# EasyEDA Pro project f1c200s测试板V1.0.eprj, schematic Schematic1
Create Date: 2023-12-29; Page Name: P1; Project Name: f1c200s测试板V1.0; Schematic Name: Schematic1; Update Date: 2024-01-06; Company: 嘉立创EDA; Drawed: lhdjply; Page Size: A4; Reviewed: lhdjply; Version: V1.0
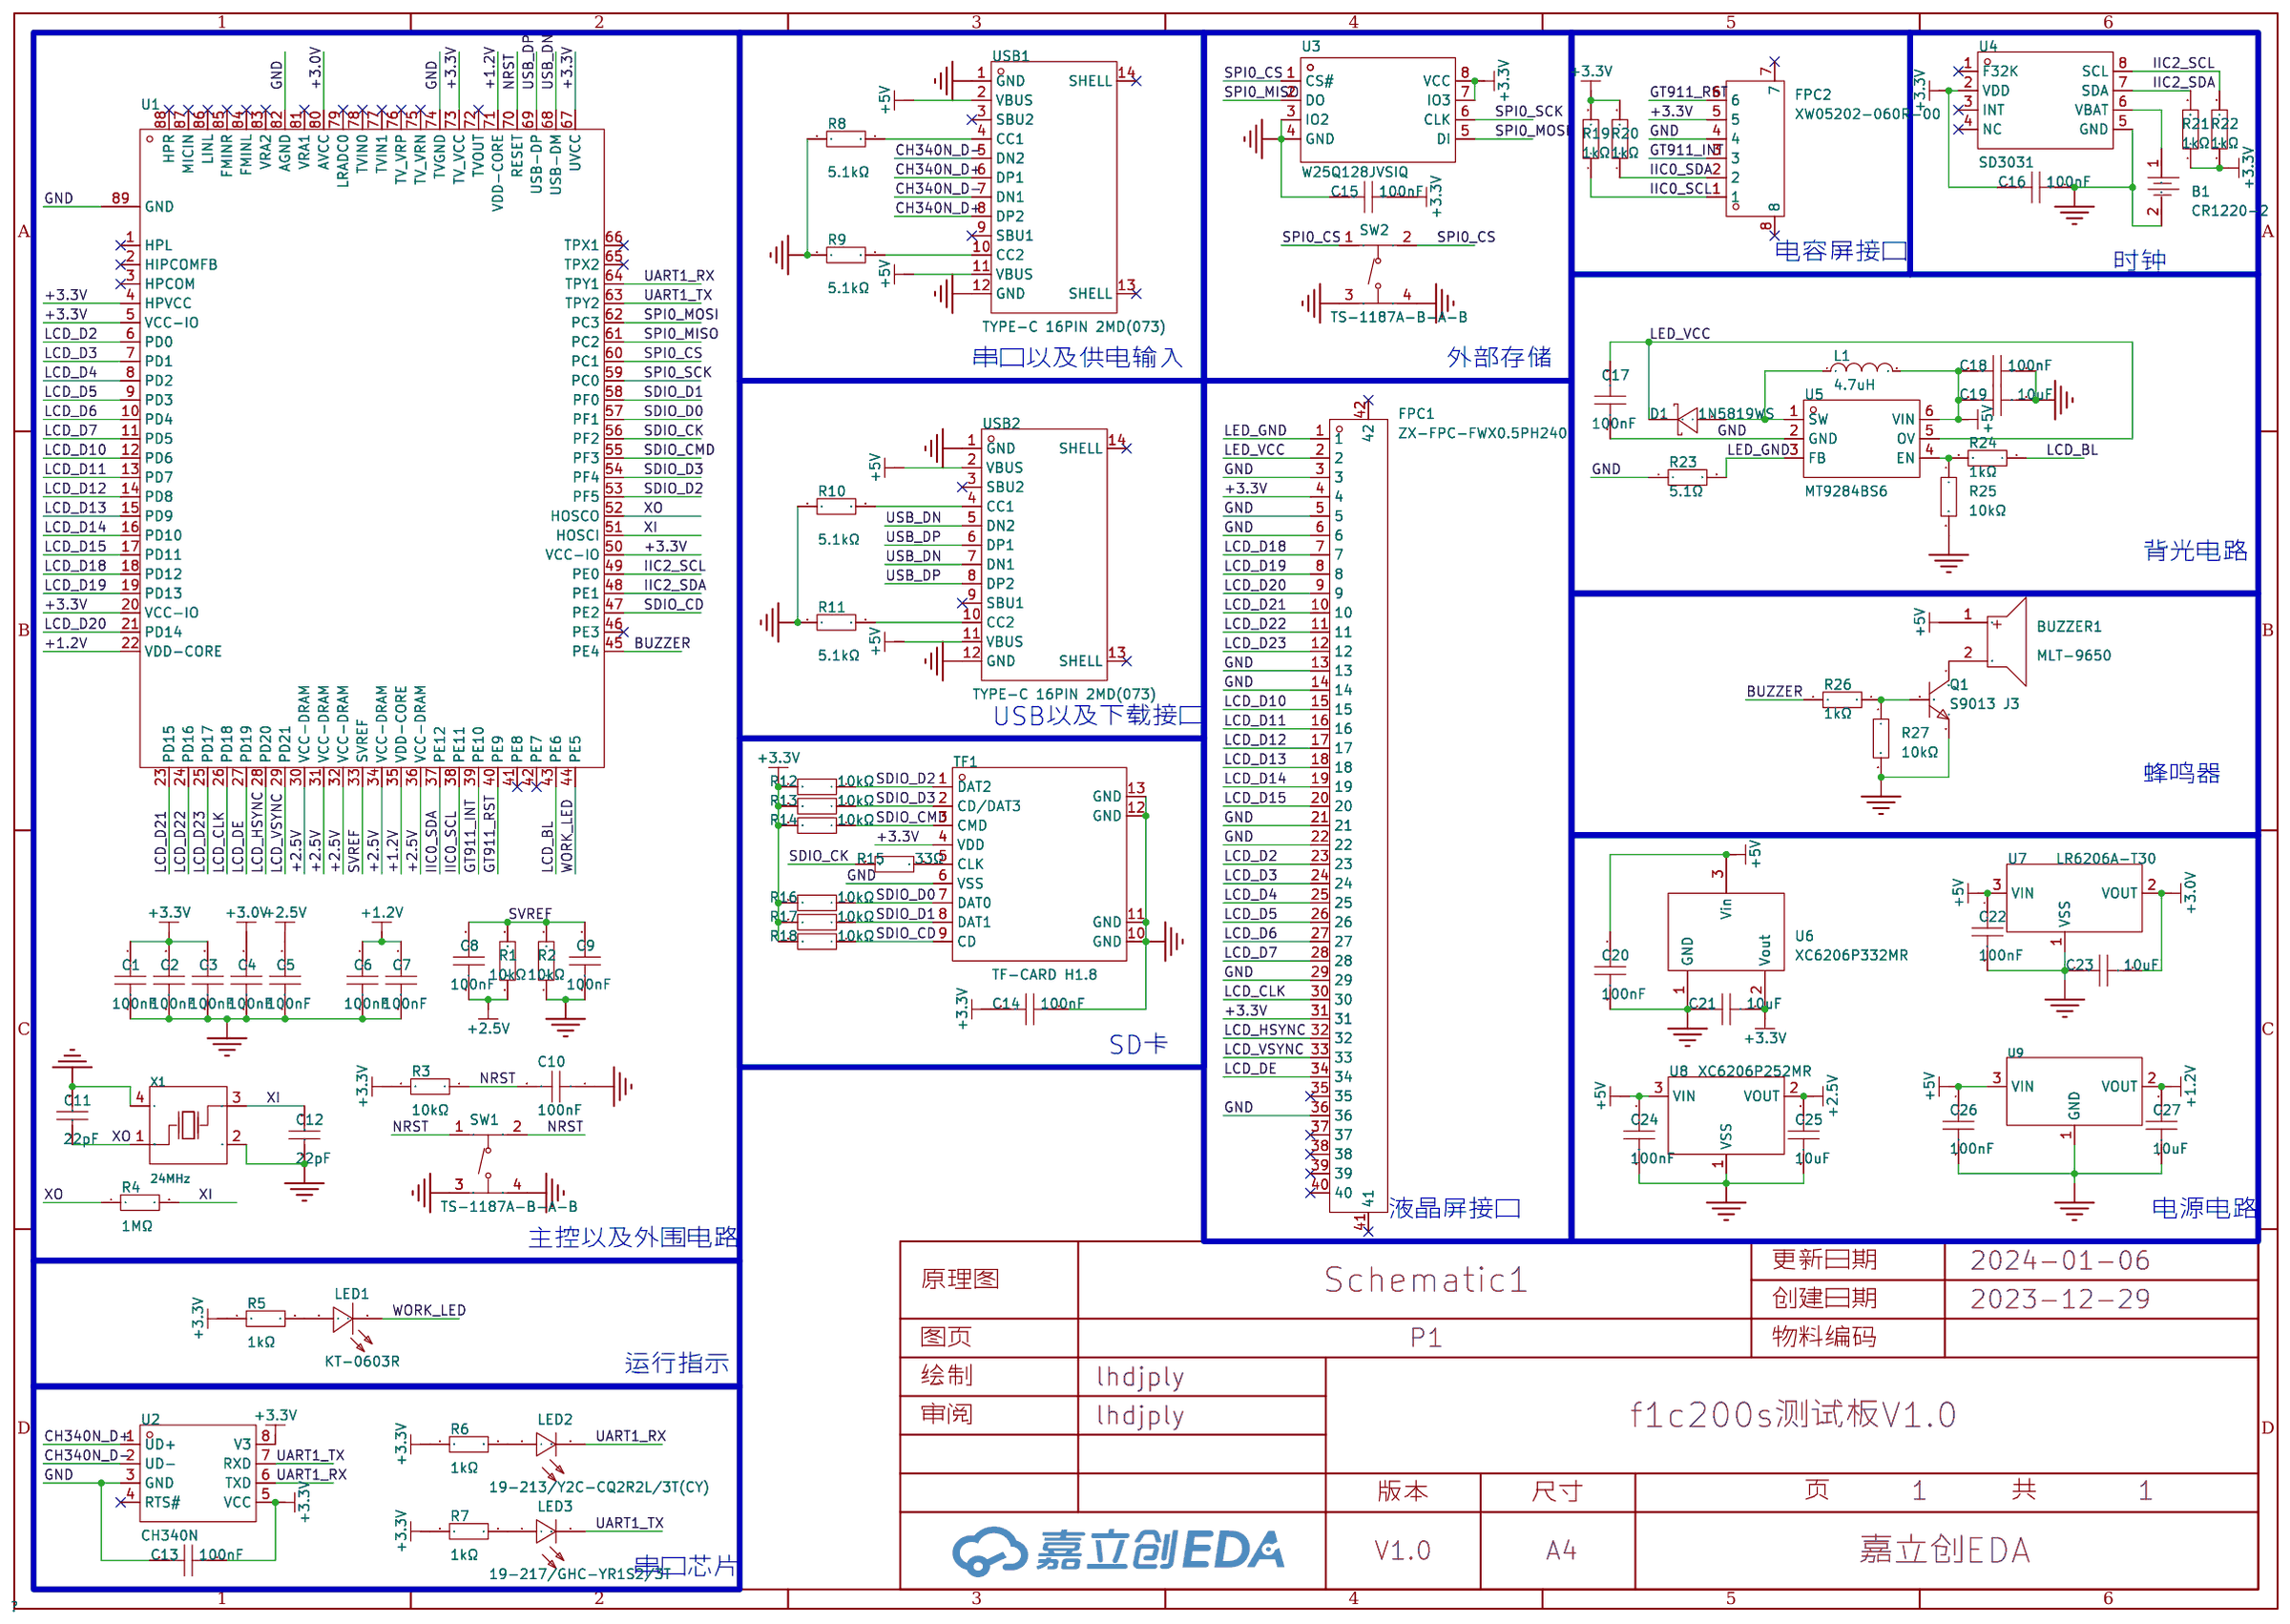
[diagram p0: schematic sheet]

## Parts
B1  CR1220-2  [BAT-SMD_CR1220-2]
BUZZER1  2700Hz  [BUZ-SMD_L9.6-W9.6-LS10.0-R]
C1  100nF  [C0603]
C2  100nF  [C0603]
C3  100nF  [C0603]
C4  100nF  [C0603]
C5  100nF  [C0603]
C6  100nF  [C0603]
C7  100nF  [C0603]
C8  100nF  [C0603]
C9  100nF  [C0603]
C10  100nF  [C0603]
C11  22pF  [C0603]
C12  22pF  [C0603]
C13  100nF  [C0603]
C14  100nF  [C0603]
C15  100nF  [C0603]
C16  100nF  [C0603]
C17  100nF  [C0603]
C18  100nF  [C0603]
C19  10uF  [C0603]
C20  100nF  [C0603]
C21  10uF  [C0603]
C22  100nF  [C0603]
C23  10uF  [C0603]
C24  100nF  [C0603]
C25  10uF  [C0603]
C26  100nF  [C0603]
C27  10uF  [C0603]
D1  1N5819WS  [SOD-323_L1.8-W1.3-LS2.5-RD]
FPC1  ZX-FPC-FWX0.5PH240  [FPC-SMD_40P-P0.50_MEGASTAR_ZX-FPC-FWX0.5PH240]
FPC2  XW05202-060R-00  [FPC-SMD_XW05202-060R-00]
L1  4.7uH  [IND-SMD_L5.8-W5.2_SLF05XX]
LED1  KT-0603R  [LED0603-RD]
LED2  19-213/Y2C-CQ2R2L/3T(CY)  [LED0603-RD-YELLOW]
LED3  19-217/GHC-YR1S2/3T  [LED0603-RD]
Q1  S9013 J3  [SOT-23-3_L2.9-W1.3-P1.90-LS2.4-BR]
R1  10kΩ  [R0603]
R2  10kΩ  [R0603]
R3  10kΩ  [R0603]
R4  1MΩ  [R0603]
R5  1kΩ  [R0603]
R6  1kΩ  [R0603]
R7  1kΩ  [R0603]
R8  5.1kΩ  [R0603]
R9  5.1kΩ  [R0603]
R10  5.1kΩ  [R0603]
R11  5.1kΩ  [R0603]
R12  10kΩ  [R0603]
R13  10kΩ  [R0603]
R14  10kΩ  [R0603]
R15  33Ω  [R0603]
R16  10kΩ  [R0603]
R17  10kΩ  [R0603]
R18  10kΩ  [R0603]
R19  1kΩ  [R0603]
R20  1kΩ  [R0603]
R21  1kΩ  [R0603]
R22  1kΩ  [R0603]
R23  5.1Ω  [R0603]
R24  1kΩ  [R0603]
R25  10kΩ  [R0603]
R26  1kΩ  [R0603]
R27  10kΩ  [R0603]
SW1  TS-1187A-B-A-B  [SW-SMD_4P-L5.1-W5.1-P3.70-LS6.5-TL-2]
SW2  TS-1187A-B-A-B  [SW-SMD_4P-L5.1-W5.1-P3.70-LS6.5-TL-2]
TF1  TF-CARD H1.8  [TF-SMD_TF-CARD-H1.8]
U1  F1C200S  [QFN-88_L10.0-W10.0-P0.40-BL-EP6.75]
U2  CH340N  [SOP-8_L4.9-W3.9-P1.27-LS6.0-BL]
U3  W25Q128JVSIQ  [SOIC-8_L5.3-W5.3-P1.27-LS8.0-BL]
U4  SD3031  [SOP-8_L5.3-W5.3-P1.27-LS8.0-BL]
U5  MT9284BS6  [SOT-23-6_L2.9-W1.6-P0.95-LS2.8-BR]
U6  XC6206P332MR  [SOT-23-3_L2.9-W1.6-P1.90-LS2.8-BR]
U7  LR6206A-T30  [SOT-23-3_L2.9-W1.3-P1.90-LS2.4-BR]
U8  XC6206P252MR  [SOT-23-3_L2.9-W1.3-P1.90-LS2.4-BR]
U9  LR8103A-T12  [SOT-23-3_L2.9-W1.6-P1.90-LS2.8-BR]
USB1  TYPE-C 16PIN 2MD(073)  [USB-C-SMD_TYPE-C-6PIN-2MD-073]
USB2  TYPE-C 16PIN 2MD(073)  [USB-C-SMD_TYPE-C-6PIN-2MD-073]
X1  24MHz  [CRYSTAL-SMD_4P-L3.2-W2.5-BL-2]

## Library data of the parts
B1 = CR1220-2: 连接器类型:电池底座;适用电池规格:CR1220;工作温度范围:-;; LCSC Part Name: 电池底座 适用电池:CR1220; Supplier Part: C70381; Manufacturer: Q&amp;J; Supplier Footprint: SMD; JLCPCB Part Class: Extended Part; Datasheet: https://atta.szlcsc.com/upload/public/pdf/source/20160427/1461725216696.pdf; Supplier: LCSC; Connector Type: 电池底座; Battery Type: CR1220
BUZZER1 = MLT-9650: 驱动方式:有源(内含驱动线路);构造类型:电磁式;额定电压:5V;工作电压:3V~7V;频率:2700Hz;声压(SPL):85dB@5V,10cm;长度:9.6mm;宽度:9.6mm;高度:5.5mm;; LCSC Part Name: 耐环保MLT-9650; Supplier Part: C96127; Manufacturer: 华能; JLCPCB Part Class: 扩展库; Datasheet: https://atta.szlcsc.com/upload/public/pdf/source/20170914/C96127_1505374148680969227.pdf; Supplier: LCSC; Oscillator Circuit: 有源(内含驱动线路); Technology Type: 电磁式; Rated Voltage: 5V; Operating Voltage: 3V~7V; Sound Pressure Level (SPL): 85dB@5V,10cm; Length: 9.6mm; Width: 9.6mm; Height: 5.5mm
C1-C10 C13-C18 C20 C22 C24 C26 = CC0603KRX7R9BB104: 容值:100nF;精度:±10%;额定电压:50V;材质(温度系数):X7R;; LCSC Part Name: 100nF ±10% 50V; Supplier Part: C14663; Manufacturer: YAGEO(国巨); Supplier Footprint: 0603; JLCPCB Part Class: 基础库; Datasheet: https://atta.szlcsc.com/upload/public/pdf/source/20180910/C282072_33301C7F631E79921B82A8DAC6BCC5B3.pdf; Supplier: LCSC; Tolerance: ±10%; Voltage Rated: 50V; Temperature Coefficient: X7R
C11 C12 = CL10C220JB8NNNC: 容值:22pF;精度:±5%;额定电压:50V;材质(温度系数):C0G;; LCSC Part Name: 22pF ±5% 50V; Supplier Part: C1653; Manufacturer: SAMSUNG(三星); Supplier Footprint: 0603; JLCPCB Part Class: 基础库; Datasheet: https://atta.szlcsc.com/upload/public/pdf/source/20160218/1457707763339.pdf; Supplier: LCSC; Tolerance: ±5%; Voltage Rated: 50V; Temperature Coefficient: C0G
C19 C21 C23 C25 C27 = CL10A106KP8NNNC: 容值:10uF;精度:±10%;额定电压:10V;材质(温度系数):X5R;; LCSC Part Name: 10uF ±10% 10V; Supplier Part: C19702; Manufacturer: SAMSUNG(三星); Supplier Footprint: 0603; JLCPCB Part Class: 基础库; Datasheet: https://atta.szlcsc.com/upload/public/pdf/source/20160218/1457707763339.pdf; Supplier: LCSC; Tolerance: ±10%; Voltage Rated: 10V; Temperature Coefficient: X5R
D1 = 1N5819WS_C191023: 正向压降(Vf):600mV@1A;直流反向耐压(Vr):40V;平均整流电流(Io):1A;; LCSC Part Name: 电压:40V 电流:1A; Supplier Part: C191023; Manufacturer: Hottech(合科泰); Supplier Footprint: SOD-323; JLCPCB Part Class: 基础库; Datasheet: https://atta.szlcsc.com/upload/public/pdf/source/20220428/3CB86FD8D28D653594B4E35F9D5AEFD9.pdf; Supplier: LCSC; Forward Voltage (Vf@If): 600mV@1A; Reverse Voltage (Vr): 40V; Average Rectified Current (Io): 1A
FPC1 = ZX-FPC-FWX0.5PH240: 间距:0.5mm;触点数量:40P;锁定特性:翻盖式;触点类型:下接;安装类型:卧贴;工作温度范围:-25℃~+85℃;焊接温度(最大值):260℃;; LCSC Part Name: 间距:0.5mm P数:40P 翻盖式 下接; Supplier Part: C7419871; Manufacturer: Megastar(兆星); Supplier Footprint: SMD,P=0.5mm,卧贴; JLCPCB Part Class: 扩展库; Datasheet: https://atta.szlcsc.com/upload/public/pdf/source/20230601/0995AEA2524149388278E8B9E81F922A.pdf; Supplier: LCSC; Pitch: 0.5mm; Number of Contacts: 40P; Locking Feature: 翻盖式; FFC, FCB Thickness: 0.3mm; Contact Type: 下接; Mounting Type: 卧贴; Height Above Board: 2mm; Operating Temperature Range: -25℃~+85℃; Welding Temperature (Max): 260℃
FPC2 = XW05202-060R-00: 间距:0.5mm;触点数量:6P;锁定特性:翻盖式;触点类型:下接;安装类型:卧贴;工作温度范围:-25℃~+85℃;; LCSC Part Name: 间距:0.5mm P数:6P 翻盖式 下接; Supplier Part: C2906110; Manufacturer: HCTL(华灿天禄); Supplier Footprint: SMD,P=0.5mm,卧贴; JLCPCB Part Class: 扩展库; Datasheet: https://atta.szlcsc.com/upload/public/pdf/source/20231106/C384EBACC26E247929F51DC405C2A717.pdf; Supplier: LCSC; Pitch: 0.5mm; Number of Contacts: 6P; Locking Feature: 翻盖式; FFC, FCB Thickness: 0.3mm; Contact Type: 下接; Mounting Type: 卧贴; Height Above Board: 2mm; Operating Temperature Range: -25℃~+85℃
L1 = CD54N-4R7M: 电感值:4.7uH;精度:±20%;额定电流:3A;饱和电流(Isat):3A;; LCSC Part Name: 4.7uH ±20% 3A 80mΩ; Supplier Part: C2875604; Manufacturer: MINGSTAR(登壹); Supplier Footprint: SMD,5.5x5.8mm; JLCPCB Part Class: 扩展库; Datasheet: https://atta.szlcsc.com/upload/public/pdf/source/20210823/BCE09198A05364EC456BC39861994031.pdf; Supplier: LCSC; Tolerance: ±20%; Rated Current: 3A; Saturation Current (Isat): 3A; DC Resistance (DCR): 80mΩ
LED1 = KT-0603R: 发光颜色:红灯;二极管配置:-;透镜颜色:-;主波长:-;色温:-;功率:-;发光角度:-;安装方式:-;工作温度:-40℃~+85℃;; LCSC Part Name: 0603 红灯 高亮; Supplier Part: C2286; Manufacturer: KENTO; Supplier Footprint: 0603; JLCPCB Part Class: 基础库; Datasheet: https://atta.szlcsc.com/upload/public/pdf/source/20160616/1466072038404.pdf; Supplier: LCSC; Emitted Color: 红灯; Operating Temperature: -40℃~+85℃
LED2 = 19-213/Y2C-CQ2R2L/3T(CY): 发光颜色:黄灯;二极管配置:-;主波长:585.5nm~591.5nm;色温:-;功率:60mW;安装方式:-;; LCSC Part Name: 黄灯; Supplier Part: C72038; Manufacturer: EVERLIGHT(亿光); Supplier Footprint: 0603; JLCPCB Part Class: 基础库; Datasheet: https://atta.szlcsc.com/upload/public/pdf/source/20160507/1462613613586.pdf; Supplier: LCSC; Emitted Color: 黄灯; Lens Color: 无色透明; Dominant Wavelength: 585.5nm~591.5nm; Peak Wavelength: 591nm; Forward Current: 20mA; Power Dissipation: 60mW; Viewing Angle: 120°; Operating Temperature: -40℃~+85℃
LED3 = 19-217/GHC-YR1S2/3T: 发光颜色:翠绿色;二极管配置:-;功率:110mW;透镜颜色:无色透明透镜;主波长:520nm~535nm;色温:-;发光强度:199mcd;发光角度:120°;安装方式:-;工作温度:-40℃~+85℃;; LCSC Part Name: 翠绿; Supplier Part: C72043; Manufacturer: EVERLIGHT(亿光); Supplier Footprint: 0603; JLCPCB Part Class: 基础库; Datasheet: https://atta.szlcsc.com/upload/public/pdf/source/20160507/1462613613780.pdf; Supplier: LCSC; Emitted Color: 翠绿色; Forward Voltage (VF): 3.3V; Forward Current: 20mA; Power Dissipation: 110mW; Lens Color: 无色透明透镜; Dominant Wavelength: 520nm~535nm; Peak Wavelength: 518nm; Luminous Intensity: 199mcd; Viewing Angle: 120°; Operating Temperature: -40℃~+85℃
Q1 = S9013 J3: 晶体管类型:NPN;集电极电流(Ic):500mA;集射极击穿电压(Vceo):25V;功率(Pd):300mW;直流电流增益(hFE@Ic,Vce):200@50mA,1V;; LCSC Part Name: NPN 电流:500mA 耐压:25V H档(200-350); Supplier Part: C6749; Manufacturer: CJ(江苏长电/长晶); Supplier Footprint: SOT-23; JLCPCB Part Class: 基础库; Datasheet: https://atta.szlcsc.com/upload/public/pdf/source/20140809/1457707213610.pdf; Supplier: LCSC; Transistor Type: NPN; Collector Current (Ic): 500mA; Collector-Emitter Breakdown Voltage (Vceo): 25V; Power Dissipation (Pd): 300mW; DC Current Gain (hFE@Ic,Vce): 200@50mA,1V; Transition Frequency (fT): 150MHz; Collector Cut-Off Current (Icbo): 100nA; Collector-Emitter Saturation Voltage (VCE(sat)@Ic,Ib): 600mV@500mA,50mA
R1-R3 R12-R14 R16-R18 R25 R27 = 0603WAF1002T5E: 阻值:10kΩ;精度:±1%;功率:100mW;温度系数:±100ppm/℃;电阻类型:厚膜电阻;; LCSC Part Name: 10kΩ ±1% 100mW 厚膜电阻; Supplier Part: C25804; Manufacturer: UNI-ROYAL(厚声); Supplier Footprint: 0603; JLCPCB Part Class: Basic Part; Datasheet: https://atta.szlcsc.com/upload/public/pdf/source/20200306/C422600_1E6D84923E4A46A82E41ADD87F860B5C.pdf; Supplier: LCSC; Tolerance: ±1%; Power(Watts): 100mW; Overload Voltage (Max): 75V; Temperature Coefficient: ±100ppm/℃; Type: 厚膜电阻; Operating Temperature Range: -55℃~+155℃
R4 = 0603WAF1004T5E: 阻值:1MΩ;精度:±1%;功率:100mW;温度系数:±100ppm/℃;电阻类型:厚膜电阻;; LCSC Part Name: 1MΩ ±1% 100mW 厚膜电阻; Supplier Part: C22935; Manufacturer: UNI-ROYAL(厚声); Supplier Footprint: 0603; JLCPCB Part Class: 基础库; Datasheet: https://atta.szlcsc.com/upload/public/pdf/source/20200306/C422600_1E6D84923E4A46A82E41ADD87F860B5C.pdf; Supplier: LCSC; Tolerance: ±1%; Power(Watts): 100mW; Overload Voltage (Max): 75V; Temperature Coefficient: ±100ppm/℃; Type: 厚膜电阻; Operating Temperature Range: -55℃~+155℃
R5-R7 R19-R22 R24 R26 = 0603WAF1001T5E: 阻值:1kΩ;精度:±1%;功率:100mW;温度系数:±100ppm/℃;电阻类型:厚膜电阻;; LCSC Part Name: 1kΩ ±1% 100mW 厚膜电阻; Supplier Part: C21190; Manufacturer: UNI-ROYAL(厚声); Supplier Footprint: 0603; JLCPCB Part Class: 基础库; Datasheet: https://atta.szlcsc.com/upload/public/pdf/source/20200306/C422600_1E6D84923E4A46A82E41ADD87F860B5C.pdf; Supplier: LCSC; Tolerance: ±1%; Power(Watts): 100mW; Overload Voltage (Max): 75V; Temperature Coefficient: ±100ppm/℃; Type: 厚膜电阻; Operating Temperature Range: -55℃~+155℃
R8-R11 = 0603WAF5101T5E: 阻值:5.1kΩ;精度:±1%;功率:100mW;温度系数:±100ppm/℃;电阻类型:厚膜电阻;; LCSC Part Name: 5.1kΩ ±1% 100mW 厚膜电阻; Supplier Part: C23186; Manufacturer: UNI-ROYAL(厚声); Supplier Footprint: 0603; JLCPCB Part Class: 基础库; Datasheet: https://atta.szlcsc.com/upload/public/pdf/source/20200306/C422600_1E6D84923E4A46A82E41ADD87F860B5C.pdf; Supplier: LCSC; Tolerance: ±1%; Power(Watts): 100mW; Overload Voltage (Max): 75V; Temperature Coefficient: ±100ppm/℃; Type: 厚膜电阻; Operating Temperature Range: -55℃~+155℃
R15 = 0603WAF330JT5E: 阻值:33Ω;精度:±1%;功率:100mW;温度系数:±100ppm/℃;电阻类型:厚膜电阻;; LCSC Part Name: 33Ω ±1% 100mW 厚膜电阻; Supplier Part: C23140; Manufacturer: UNI-ROYAL(厚声); Supplier Footprint: 0603; JLCPCB Part Class: 基础库; Datasheet: https://atta.szlcsc.com/upload/public/pdf/source/20200306/C422600_1E6D84923E4A46A82E41ADD87F860B5C.pdf; Supplier: LCSC; Tolerance: ±1%; Power(Watts): 100mW; Overload Voltage (Max): 75V; Temperature Coefficient: ±100ppm/℃; Type: 厚膜电阻; Operating Temperature Range: -55℃~+155℃
R23 = 0603WAF510KT5E: 阻值:5.1Ω;精度:±1%;功率:100mW;温度系数:±200ppm/℃;电阻类型:厚膜电阻;; LCSC Part Name: 5.1Ω ±1% 100mW 厚膜电阻; Supplier Part: C25197; Manufacturer: UNI-ROYAL(厚声); Supplier Footprint: 0603; JLCPCB Part Class: 基础库; Datasheet: https://atta.szlcsc.com/upload/public/pdf/source/20200306/C422600_1E6D84923E4A46A82E41ADD87F860B5C.pdf; Supplier: LCSC; Tolerance: ±1%; Power(Watts): 100mW; Overload Voltage (Max): 75V; Temperature Coefficient: ±200ppm/℃; Type: 厚膜电阻; Operating Temperature Range: -55℃~+155℃
SW1 SW2 = TS-1187A-B-A-B: 触点电流:50mA;额定电压(DC):12V;绝缘电阻:-;电路结构:单刀单掷;安装方式:立贴;带灯:无;作用力:160gf;机械寿命:10万次;带支架:否;; LCSC Part Name: 5.1*5.1*1.5mm 立贴 轻触开关 防水金属头; Supplier Part: C318884; Manufacturer: XKB Connectivity(中国星坤); Supplier Footprint: SMD; JLCPCB Part Class: 基础库; Datasheet: https://atta.szlcsc.com/upload/public/pdf/source/20200227/C318884_1F20165719E1C4CAA3E10C4C359C6E26.pdf; Supplier: LCSC; Contact Current: 50mA; Voltage Rating (DC): 12V; Circuit: 单刀单掷; Mounting Style: 立贴; Actuator Style: 圆形按钮; Actuator/Cap Color: 金色; With Lamp: 无; Operating Force: 160gf; Mechanical Life: 10万次; Operating Temperature: -30℃~+85℃; Switch Length: 5.1mm; Switch Width: 5.1mm; Switch Height: 1.5mm; Strike Gundam: 否
TF1 = TF-CARD H1.8: 卡连接方式:自弹式;卡类型:MicroSD卡(TF卡);连接器类型:卡座;本体最大高度:1.8mm;触头材质:铜合金;触头镀层:金;工作温度范围:-40℃~+70℃;; LCSC Part Name: 自弹式 MicroSD卡(TF卡) 卡座; Supplier Part: C7529389; Manufacturer: SHOU HAN(首韩); Supplier Footprint: SMD; JLCPCB Part Class: 扩展库; Datasheet: https://atta.szlcsc.com/upload/public/pdf/source/20230818/611DB5E7B45C91025B0B37F957961A64.pdf; Supplier: LCSC; Card Connection Mode: 自弹式; Card Type: MicroSD卡(TF卡); Connector Type: 卡座; Maximum Body Height: 1.8mm; Contact Material: 铜合金; Contact Plating: 金; Operating Temperature Range: -40℃~+70℃
U1 = F1C200S: CPU内核:-;GPIO端口数量:-;工作电压范围:-;CPU最大主频:-;程序存储器类型:-;; LCSC Part Name: Allwinner F1C200S; Supplier Part: C2879851; Manufacturer: Allwinner(全志); Supplier Footprint: QFN-88-EP(10x10); Datasheet: https://atta.szlcsc.com/upload/public/pdf/source/20211016/C2879851_80200E64F493B5C5B5C583D1EECFE2F1.pdf; Supplier: LCSC
U2 = CH340N: LCSC Part Name: USB转串口芯片 CH340; Supplier Part: C2977777; Manufacturer: WCH(南京沁恒); Supplier Footprint: SOP-8; JLCPCB Part Class: 扩展库; Datasheet: https://atta.szlcsc.com/upload/public/pdf/source/20230530/6E401E9554E9F5311886CC8B3F89B62E.pdf; Supplier: LCSC
U3 = W25Q128JVSIQ: 接口类型:-;存储容量:128Mbit;时钟频率(fc):-;; LCSC Part Name: W25Q128JVSIQ 编带; Supplier Part: C97521; Manufacturer: WINBOND(华邦); Supplier Footprint: SOP-8-208mil; JLCPCB Part Class: Basic Part; Datasheet: https://atta.szlcsc.com/upload/public/pdf/source/20170316/1489627409956.pdf; Supplier: LCSC; Memory Size: 128Mbit
U4 = SD3031: 内置晶振,管脚兼容3231，IIC接口，低功耗常温±3.8PPM可以全温度范围补偿，工作电压2.7V-5.5V,工作温度-40℃-+85℃,内置70字节寄存器，32.768HZ方波输出，具备充电功能及电池电压测量功能; LCSC Part Name: 时钟芯片 SD3031; Supplier Part: C2988356; Manufacturer: WAVE(兴威帆电子); Supplier Footprint: SOP-8-208mil; JLCPCB Part Class: 扩展库; Datasheet: https://atta.szlcsc.com/upload/public/pdf/source/20220531/BC093BDA2F8B8D0080286777E4EE97F8.pdf; Supplier: LCSC
U5 = MT9284BS6: Supplier Part: C181740; Manufacturer: 西安航天民芯; Supplier Footprint: SOT-23-6; JLCPCB Part Class: 扩展库; Datasheet: https://atta.szlcsc.com/upload/public/pdf/source/20180228/C181740_15198093817741379334.pdf; Supplier: LCSC
U6 = XC6206P332MR_C5446: 输出类型:固定;输出极性:正;最大输入电压:6V;输出电压:3.3V;输出电流:200mA;电源纹波抑制比(PSRR):-;; Supplier Part: C5446; Manufacturer: TOREX(特瑞仕); Supplier Footprint: SOT-23-3L; JLCPCB Part Class: 基础库; Datasheet: https://atta.szlcsc.com/upload/public/pdf/source/20130801/1457706628791.pdf; Supplier: LCSC; Output Type: 固定; Output Polarity: 正; Number of Outputs: 1; Maximum Input Voltage: 6V; Output Voltage: 3.3V; Dropout Voltage: 680mV@(100mA); Output Current: 200mA
U7 = LR6206A-T30: 输出类型:固定;最大输入电压:6.5V;输出电压:3V;输出电流:300mA;电源纹波抑制比(PSRR):55dB@(1kHz);输出极性:正;; LCSC Part Name: 输入6.5V 输出3V 300mA; Supplier Part: C5179961; Manufacturer: LR(朗瑞); Supplier Footprint: SOT-23-3L; JLCPCB Part Class: 扩展库; Datasheet: https://atta.szlcsc.com/upload/public/pdf/source/20220921/9D913997C0FE9084E01FD95780CDD239.pdf; Supplier: LCSC; Output Type: 固定; Maximum Input Voltage: 6.5V; Output Voltage: 3V; Output Current: 300mA; Power Supply Rejection Ratio (PSRR): 55dB@(1kHz); Quiescent Current (Ground Current): 6uA; Operating Temperature: -10℃~+85℃; Output Polarity: 正; Number of Outputs: 1
U8 = XC6206P252MR_C5148689: 输出类型:固定;最大输入电压:8V;输出电压:2.5V;输出电流:300mA;输出极性:正;; LCSC Part Name: 输入8V 输出2.5V 300mA; Supplier Part: C5148689; Manufacturer: HXY MOSFET(华轩阳电子); Supplier Footprint: SOT-23; JLCPCB Part Class: 扩展库; Datasheet: https://atta.szlcsc.com/upload/public/pdf/source/20230315/5A1F04F22177136934A43E082802F6D9.pdf; Supplier: LCSC; Output Type: 固定; Maximum Input Voltage: 8V; Output Voltage: 2.5V; Output Current: 300mA; Dropout Voltage: 240mV@(50mA); Output Polarity: 正; Number of Outputs: 1
U9 = LR8103A-T12: 输出类型:-;最大输入电压:-;输出电压:1.2V;输出电流:300mA;电源纹波抑制比(PSRR):-;输出极性:-;; Supplier Part: C7501644; Manufacturer: LR(朗瑞); Supplier Footprint: SOT-23-3L; Datasheet: https://atta.szlcsc.com/upload/public/pdf/source/20231008/497C30F6FC000E28AFBC84D6E13E2470.pdf; Supplier: LCSC; Output Voltage: 1.2V; Output Current: 300mA; Quiescent Current (Ground Current): 800nA
USB1 USB2 = TYPE-C 16PIN 2MD(073): 连接器类型:Type-C;标准:-;公母:母;端口数量:1;触点数量:16P;安装方式:卧贴;额定电流 - 电源:5A;工作温度范围:-25℃~+85℃;; LCSC Part Name: Type-C 母 卧贴 带定位柱 不锈钢外壳 2次模顶; Supplier Part: C2765186; Manufacturer: SHOU HAN(首韩); Supplier Footprint: SMD; JLCPCB Part Class: 扩展库; Datasheet: https://atta.szlcsc.com/upload/public/pdf/source/20211123/39B17C16241EAC15C5E277BDA434118E.pdf; Supplier: LCSC; Connector Type: Type-C; Gender: 母; Number of Ports: 1; Number of Contacts: 16P; Mounting Style: 卧贴; Current Rating - Power (Max): 5A; Operating Temperature Range: -25℃~+85℃
X1 = K3A240002010: 频率:24MHz;频率公差:±10ppm;负载电容:20pF;; LCSC Part Name: 24MHz ±10ppm 20pF; Supplier Part: C368740; Manufacturer: KYX(凯越翔电子); Supplier Footprint: SMD3225-4P; JLCPCB Part Class: 扩展库; Datasheet: https://atta.szlcsc.com/upload/public/pdf/source/20190218/C368740_6927308592709ED9FC01E5CAFF372E56.pdf; Supplier: LCSC; Crystal Type: 贴片无源晶振; Frequency Tolerance: ±10ppm; Frequency Stability: ±20ppm; Load Capacitance: 20pF; Equivalent Series Resistance (ESR): 40Ω; Operating Temperature: -40℃~+85℃

## Nets
+1.2V: C6.2 C7.2 C27.2 U1.22(VDD-CORE) U1.35(VDD-CORE) U1.71(VDD-CORE) U9.2(VOUT)
+2.5V: C5.2 C8.1 C25.2 R1.1 U1.30(VCC-DRAM) U1.31(VCC-DRAM) U1.32(VCC-DRAM) U1.34(VCC-DRAM) U1.36(VCC-DRAM) U8.2(VOUT)
+3.0V: C4.2 C23.2 U1.80(AVCC) U7.2(VOUT)
+3.3V: C1.2 C2.2 C3.2 C13.1 C14.2 C15.1 C16.2 C21.2 FPC1.4 FPC1.31 FPC2.5 R3.2 R5.1 R6.1 R7.1 R12.2 R13.2 R14.2 R16.2 R17.2 R18.2 R19.2 R20.2 R21.1 R22.1 TF1.4(VDD) U1.4(HPVCC) U1.5(VCC-IO) U1.20(VCC-IO) U1.50(VCC-IO) U1.67(UVCC) U1.73(TV_VCC) U2.5(VCC) U2.8(V3) U3.7(IO3) U3.8(VCC) U4.2(VDD) U6.2(Vout)
+5V: BUZZER1.1 C18.2 C19.1 C20.1 C22.1 C24.1 C26.1 L1.2 U5.6(VIN) U6.3(Vin) U7.3(VIN) U8.3(VIN) U9.3(VIN) USB1.2(VBUS) USB1.11(VBUS) USB2.2(VBUS) USB2.11(VBUS)
GND: B1.2 C1.1 C2.1 C3.1 C4.1 C5.1 C6.1 C7.1 C9.1 C10.1 C11.2 C12.1 C13.2 C14.1 C15.2 C16.1 C17.1 C18.1 C19.2 C20.2 C21.1 C22.2 C23.1 C24.2 C25.1 C26.2 C27.1 FPC1.3 FPC1.5 FPC1.6 FPC1.13 FPC1.14 FPC1.21 FPC1.22 FPC1.29 FPC1.36 FPC2.4 Q1.2(E) R2.1 R8.1 R9.1 R10.1 R11.1 R23.1 R25.2 R27.2 SW1.3(C) SW1.4(D) SW2.3(C) SW2.4(D) TF1.6(VSS) TF1.10(GND) TF1.11(GND) TF1.12(GND) TF1.13(GND) U1.74(TVGND) U1.82(AGND) U1.89(GND) U2.3(GND) U3.3(IO2) U3.4(GND) U4.5(GND) U5.2(GND) U6.1(GND) U7.1(VSS) U8.1(VSS) U9.1(GND) USB1.1(GND) USB1.12(GND) USB2.1(GND) USB2.12(GND) X1.2 X1.4
BUZZER: R26.2 U1.45(PE4)
CH340N_D+: U2.1(UD+) USB1.6(DP1) USB1.8(DP2)
CH340N_D-: U2.2(UD-) USB1.5(DN2) USB1.7(DN1)
GT911_INT: FPC2.3 U1.39(PE10)
GT911_RST: FPC2.6 U1.40(PE9)
IIC0_SCL: FPC2.1 R19.1 U1.38(PE11)
IIC0_SDA: FPC2.2 R20.1 U1.37(PE12)
IIC2_SCL: R22.2 U1.49(PE0) U4.8(SCL)
IIC2_SDA: R21.2 U1.48(PE1) U4.7(SDA)
LCD_BL: R24.1 U1.43(PE6)
LCD_CLK: FPC1.30 U1.26(PD18)
LCD_D2: FPC1.23 U1.6(PD0)
LCD_D3: FPC1.24 U1.7(PD1)
LCD_D4: FPC1.25 U1.8(PD2)
LCD_D5: FPC1.26 U1.9(PD3)
LCD_D6: FPC1.27 U1.10(PD4)
LCD_D7: FPC1.28 U1.11(PD5)
LCD_D10: FPC1.15 U1.12(PD6)
LCD_D11: FPC1.16 U1.13(PD7)
LCD_D12: FPC1.17 U1.14(PD8)
LCD_D13: FPC1.18 U1.15(PD9)
LCD_D14: FPC1.19 U1.16(PD10)
LCD_D15: FPC1.20 U1.17(PD11)
LCD_D18: FPC1.7 U1.18(PD12)
LCD_D19: FPC1.8 U1.19(PD13)
LCD_D20: FPC1.9 U1.21(PD14)
LCD_D21: FPC1.10 U1.23(PD15)
LCD_D22: FPC1.11 U1.24(PD16)
LCD_D23: FPC1.12 U1.25(PD17)
LCD_DE: FPC1.34 U1.27(PD19)
LCD_HSYNC: FPC1.32 U1.28(PD20)
LCD_VSYNC: FPC1.33 U1.29(PD21)
LED_GND: FPC1.1 R23.2 U5.3(FB)
LED_VCC: C17.2 D1.1(K) FPC1.2 U5.5(OV)
NRST: C10.2 R3.1 SW1.1(A) SW1.2(B) U1.70(RESET)
SDIO_CD: R18.1 TF1.9(CD) U1.47(PE2)
SDIO_CK: R15.1 U1.56(PF2)
SDIO_CMD: R14.1 TF1.3(CMD) U1.55(PF3)
SDIO_D0: R16.1 TF1.7(DAT0) U1.57(PF1)
SDIO_D1: R17.1 TF1.8(DAT1) U1.58(PF0)
SDIO_D2: R12.1 TF1.1(DAT2) U1.53(PF5)
SDIO_D3: R13.1 TF1.2(CD/DAT3) U1.54(PF4)
SPI0_CS: SW2.1(A) SW2.2(B) U1.60(PC1) U3.1(CS#)
SPI0_MISO: U1.61(PC2) U3.2(DO)
SPI0_MOSI: U1.62(PC3) U3.5(DI)
SPI0_SCK: U1.59(PC0) U3.6(CLK)
SVREF: C8.2 C9.2 R1.2 R2.2 U1.33(SVREF)
UART1_RX: LED2.1(C) U1.64(TPY1) U2.6(TXD)
UART1_TX: LED3.1(C) U1.63(TPY2) U2.7(RXD)
USB_DN: U1.68(USB-DM) USB2.5(DN2) USB2.7(DN1)
USB_DP: U1.69(USB-DP) USB2.6(DP1) USB2.8(DP2)
WORK_LED: LED1.1(K) U1.44(PE5)
XI: C12.2 R4.2 U1.51(HOSCI) X1.3(OSC2)
XO: C11.1 R4.1 U1.52(HOSCO) X1.1(OSC1)
$B1_1: B1.1 U4.6(VBAT)
$BUZZER1_2: BUZZER1.2 Q1.3(C)
$D1_2: D1.2(A) L1.1 U5.1(SW)
$LED1_2: LED1.2(A) R5.2
$LED2_2: LED2.2(A) R6.2
$LED3_2: LED3.2(A) R7.2
$Q1_1: Q1.1(B) R26.1 R27.1
$R8_2: R8.2 USB1.4(CC1)
$R9_2: R9.2 USB1.10(CC2)
$R10_2: R10.2 USB2.4(CC1)
$R11_2: R11.2 USB2.10(CC2)
$R15_2: R15.2 TF1.5(CLK)
$R24_2: R24.2 R25.1 U5.4(EN)

Not connected (* = marked no-connect by the designer): FPC1 35* 37* 38* 39* 40* 41* 42*; FPC2 7* 8*; U1 1(HPL)* 2(HIPCOMFB)* 3(HPCOM)* 41(PE8)* 42(PE7)* 46(PE3)* 65(TPX2)* 66(TPX1)* 72(TVOUT)* 75(TV_VRN)* 76(TV_VRP)* 77(TVIN1)* 78(TVIN0)* 79(LRADC0)* 81(VRA1)* 83(VRA2)* 84(FMINL)* 85(FMINR)* 86(LINL)* 87(MICIN)* 88(HPR)*; U2 4(RTS#)*; U4 1(F32K)* 3(INT)* 4(NC)*; USB1 3(SBU2)* 9(SBU1)* 13(SHELL)* 14(SHELL)*; USB2 3(SBU2)* 9(SBU1)* 13(SHELL)* 14(SHELL)*

## Notes on the sheet
- 电容屏接口
- 时钟
- 串口以及供电输入
- 外部存储
- 背光电路
- USB以及下载接口
- 蜂鸣器
- SD卡
- 液晶屏接口
- 电源电路
- 主控以及外围电路
- 运行指示
- 串口芯片
